# Altium schematic sheet LCD.SchDoc
size A4
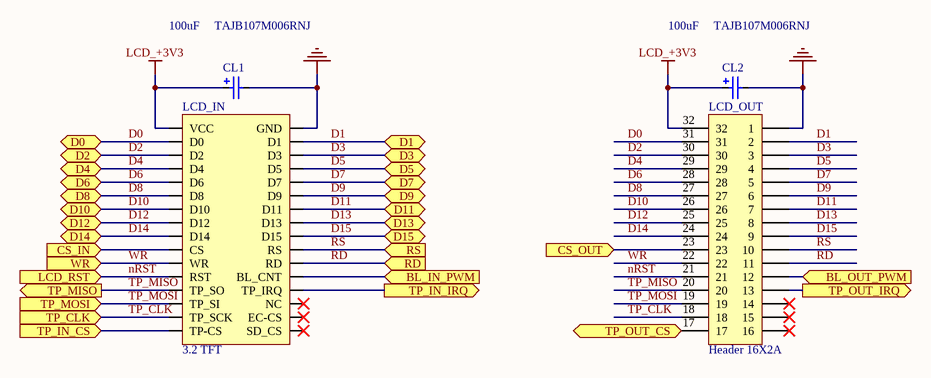
[diagram p0: LCD.SchDoc]

## Parts
CL1  value 100uF     TAJB107M006RNJ  [CAP_TAN_B_3518]  (hidden comment: Cap_Tan)
CL2  value 100uF     TAJB107M006RNJ  [CAP_TAN_B_3518]  (hidden comment: Cap_Tan)
LCD_IN  3.2 TFT  [LCD3.2]
LCD_OUT  Header 16X2A  [HDR2X16_CEN]

## Ports
BL_IN_PWM (in), BL_OUT_PWM (in), CS_IN (in), CS_OUT (in), D0 (bidir), D1 (bidir), D2 (bidir), D3 (bidir), D4 (bidir), D5 (bidir), D6 (bidir), D7 (bidir), D8 (bidir), D9 (bidir), D10 (bidir), D11 (bidir), D12 (bidir), D13 (bidir), D14 (bidir), D15 (bidir), LCD_RST (in), RD (in), RS (in), TP_CLK (in), TP_IN_CS (in), TP_IN_IRQ (out), TP_MISO (out), TP_MOSI (in), TP_OUT_CS (in), TP_OUT_IRQ (out), WR (in)

## Nets
GND: CL1.2 CL2.2 LCD_IN.2(GND) LCD_OUT.1
LCD_+3V3: CL1.1 CL2.1 LCD_IN.1(VCC) LCD_OUT.32
BL_IN_PWM: LCD_IN.24(BL_CNT) ; port BL_IN_PWM
BL_OUT_PWM: LCD_OUT.12 ; port BL_OUT_PWM
CS_IN: LCD_IN.19(CS) ; port CS_IN
CS_OUT: LCD_OUT.23 ; port CS_OUT
D0: LCD_IN.3(D0) LCD_OUT.31 ; port D0
D1: LCD_IN.4(D1) LCD_OUT.2 ; port D1
D2: LCD_IN.5(D2) LCD_OUT.30 ; port D2
D3: LCD_IN.6(D3) LCD_OUT.3 ; port D3
D4: LCD_IN.7(D4) LCD_OUT.29 ; port D4
D5: LCD_IN.8(D5) LCD_OUT.4 ; port D5
D6: LCD_IN.9(D6) LCD_OUT.28 ; port D6
D7: LCD_IN.10(D7) LCD_OUT.5 ; port D7
D8: LCD_IN.11(D8) LCD_OUT.27 ; port D8
D9: LCD_IN.12(D9) LCD_OUT.6 ; port D9
D10: LCD_IN.13(D10) LCD_OUT.26 ; port D10
D11: LCD_IN.14(D11) LCD_OUT.7 ; port D11
D12: LCD_IN.15(D12) LCD_OUT.25 ; port D12
D13: LCD_IN.16(D13) LCD_OUT.8 ; port D13
D14: LCD_IN.17(D14) LCD_OUT.24 ; port D14
D15: LCD_IN.18(D15) LCD_OUT.9 ; port D15
nRST: LCD_IN.23(RST) LCD_OUT.21 ; port LCD_RST
RD: LCD_IN.22(RD) LCD_OUT.11 ; port RD
RS: LCD_IN.20(RS) LCD_OUT.10 ; port RS
TP_CLK: LCD_IN.29(TP_SCK) LCD_OUT.18 ; port TP_CLK
TP_IN_CS: LCD_IN.31(TP-CS) ; port TP_IN_CS
TP_IN_IRQ: LCD_IN.26(TP_IRQ) ; port TP_IN_IRQ
TP_MISO: LCD_IN.25(TP_SO) LCD_OUT.20 ; port TP_MISO
TP_MOSI: LCD_IN.27(TP_SI) LCD_OUT.19 ; port TP_MOSI
TP_OUT_CS: LCD_OUT.17 ; port TP_OUT_CS
TP_OUT_IRQ: LCD_OUT.13 ; port TP_OUT_IRQ
WR: LCD_IN.21(WR) LCD_OUT.22 ; port WR

Not connected (* = marked no-connect by the designer): LCD_IN 28(NC)* 30(EC-CS)* 32(SD_CS)*; LCD_OUT 14* 15* 16*

## Library data of the parts
CL1 CL2 = Cap_Tan: Capacitor
LCD_IN = LCD3.2
LCD_OUT = Header 16X2A: Header, 16-Pin, Dual row; LatestRevisionDate: 17-Jul-2002; LatestRevisionNote: Re-released for DXP Platform.; Publisher: Altium Limited